# EasyEDA schematic SCH_555-circuit_2025-12-22.json
TITLE: Sheet_1; REV: 1.0; Date: 2025-12-22; Sheet: 1/1; Drawn By: 555 Circuit; Company: Your Company
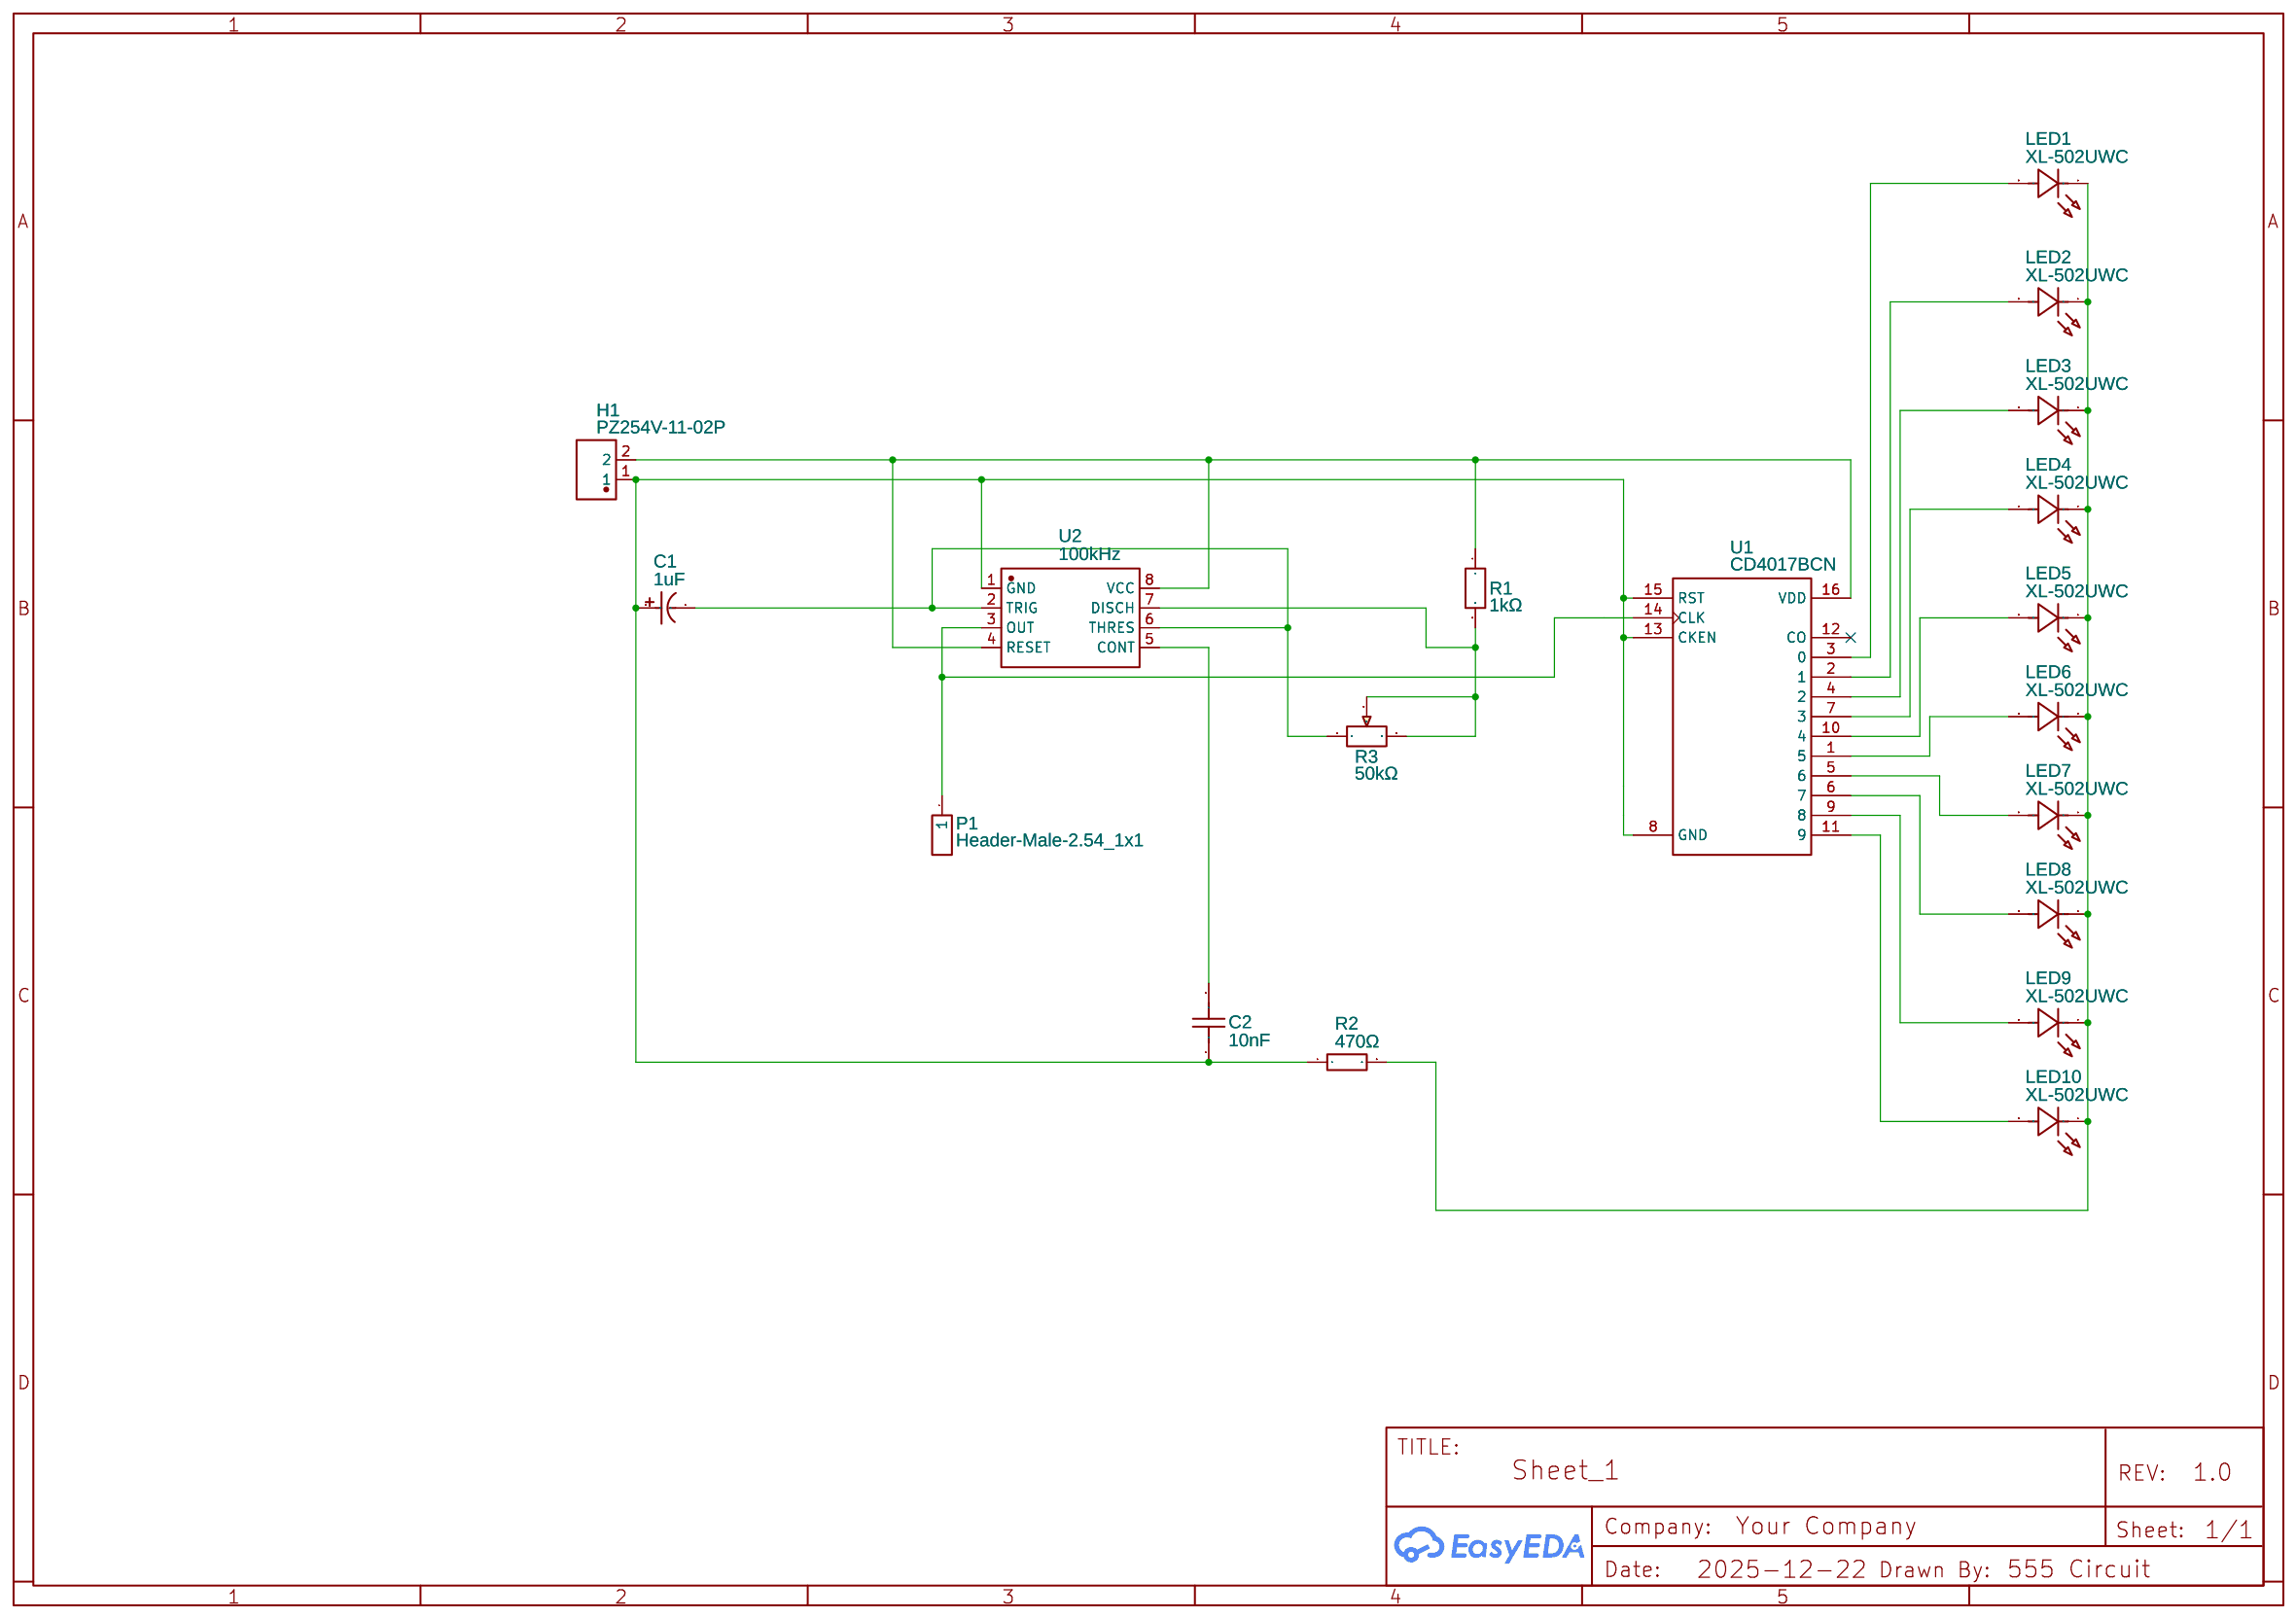
[diagram p0: schematic sheet]

## Parts
C1  1uF  [CAP-TH_BD5.0-P2.00-D0.8-FD]
C2  10nF  [CAP-TH_L8.0-W4.0-P5.00-D1.2]
H1  PZ254V-11-02P  [HDR-TH_2P-P2.54-V-M]
LED1  XL-502UWC  [LED-TH_BD5.9-P2.54-RD_WHITE]
LED2  XL-502UWC  [LED-TH_BD5.9-P2.54-RD_WHITE]
LED3  XL-502UWC  [LED-TH_BD5.9-P2.54-RD_WHITE]
LED4  XL-502UWC  [LED-TH_BD5.9-P2.54-RD_WHITE]
LED5  XL-502UWC  [LED-TH_BD5.9-P2.54-RD_WHITE]
LED6  XL-502UWC  [LED-TH_BD5.9-P2.54-RD_WHITE]
LED7  XL-502UWC  [LED-TH_BD5.9-P2.54-RD_WHITE]
LED8  XL-502UWC  [LED-TH_BD5.9-P2.54-RD_WHITE]
LED9  XL-502UWC  [LED-TH_BD5.9-P2.54-RD_WHITE]
LED10  XL-502UWC  [LED-TH_BD5.9-P2.54-RD_WHITE]
P1  Header-Male-2.54_1x1  [HDR-TH_1P-P2.54-V-M]
R1  1kΩ  [RES-TH_BD2.3-L6.5-P10.50-D0.5]
R2  470Ω  [RES-TH_BD2.2-L6.5-P10.50-D0.6]
R3  50kΩ  [RES-ADJ-TH_3P-L9.5-W4.85-P2.50-BL-L]
U1  CD4017BCN  [DIP16]
U2  100kHz  [DIP-8_L9.8-W6.6-P2.54-LS7.6-BL]

## Library data of the parts
C1 = KF010M050C110A: Supplier: LCSC; Manufacturer: CapXon(丰宾); Supplier Part: C62934; JLCPCB Part Class: Extended Part
C2 = N09F1B103MN0B0S0N0: Contributor: LCSC; Supplier: LCSC; Supplier Part: C249157; Manufacturer: STE(松田); JLCPCB Part Class: Extended Part
H1 = PZ254V-11-02P: Contributor: LCSC; Supplier: LCSC; Supplier Part: C492401; Manufacturer: XFCN(兴飞); JLCPCB Part Class: Extended Part
LED1-LED10 = XL-502UWC: Contributor: LCSC; Supplier: LCSC; Supplier Part: C2895480; Manufacturer: XINGLIGHT(成兴光); JLCPCB Part Class: Extended Part
P1 = Header-Male-2.54_1x1: Supplier: LCSC; Manufacturer: BOOMELE(博穆精密); Manufacturer Part: 2.54-1*1P针; Supplier Part: C81276; JLCPCB Part Class: Extended Part
R1 = MF1/4W-1KΩ±1%T52: Contributor: LCSC; Supplier: LCSC; Supplier Part: C713997; Manufacturer: 华星机电; JLCPCB Part Class: Extended Part
R2 = MFR0W4F4700A50: Supplier: LCSC; Manufacturer: UNI-ROYAL(厚声); Supplier Part: C58592; JLCPCB Part Class: Extended Part
R3 = 3296X-1-503_C118912: Resistance(Ohms): 50K; Contributor: LCSC; Supplier: LCSC; Supplier Part: C118912; Manufacturer: BOCHEN(博晨); Manufacturer Part: 3296X-1-503; JLCPCB Part Class: Extended Part
U1 = CD4017BCN: Decade CounterDivider with 10 Decoded Outputs
U2 = NE555P: Supplier: LCSC; Manufacturer: TI(德州仪器); Supplier Part: C46749; JLCPCB Part Class: Extended Part

## Nets
Net-(C1-1): C1.1 C2.1 H1.1 R2.1 U1.8(GND) U1.13(CKEN) U1.15(RST) U2.1(GND)
Net-(C1-2): C1.2 R3.1 U2.2(TRIG) U2.6(THRES)
Net-(C2-2): C2.2 U2.5(CONT)
Net-(H1-2): H1.2 R1.1 U1.16(VDD) U2.4(RESET) U2.8(VCC)
Net-(LED1-1): LED1.1(K) LED2.1(K) LED3.1(K) LED4.1(K) LED5.1(K) LED6.1(K) LED7.1(K) LED8.1(K) LED9.1(K) LED10.1(K) R2.2
Net-(LED1-2): LED1.2(A) U1.3(0)
Net-(LED2-2): LED2.2(A) U1.2(1)
Net-(LED3-2): LED3.2(A) U1.4(2)
Net-(LED4-2): LED4.2(A) U1.7(3)
Net-(LED5-2): LED5.2(A) U1.10(4)
Net-(LED6-2): LED6.2(A) U1.1(5)
Net-(LED7-2): LED7.2(A) U1.5(6)
Net-(LED8-2): LED8.2(A) U1.6(7)
Net-(LED9-2): LED9.2(A) U1.9(8)
Net-(LED10-2): LED10.2(A) U1.11(9)
Net-(P1-1): P1.1 U1.14(CLK) U2.3(OUT)
Net-(R1-2): R1.2 R3.2 R3.3 U2.7(DISCH)

Not connected (* = marked no-connect by the designer): U1 12(CO)*
